# Altium schematic sheet Ext_conn.schdoc: Kasli-DIOT
size 420 x 297 mm; EDA_Number: ARTIQ; Projet: ARTIQ/SINARA; Author: G.Kasprowicz; CompanyName: WUT ISE; DrawnBy: F.Świtakowski; Organization: WUT ISE; Address1: PW ISE; Address2: Nowowiejska 15/19 00-665 Warsaw; Address3: gkasprow@gmail.com; DocumentNumber: 16; SheetNumber: 13; SheetTotal: 16; ModifiedBy: -; CheckedDate: -; Title2: Ext conn; DivGrp: WUT ISE; Designer: F.Świtakowski; ModifiedDate: -; ProjectName: Sensor Box
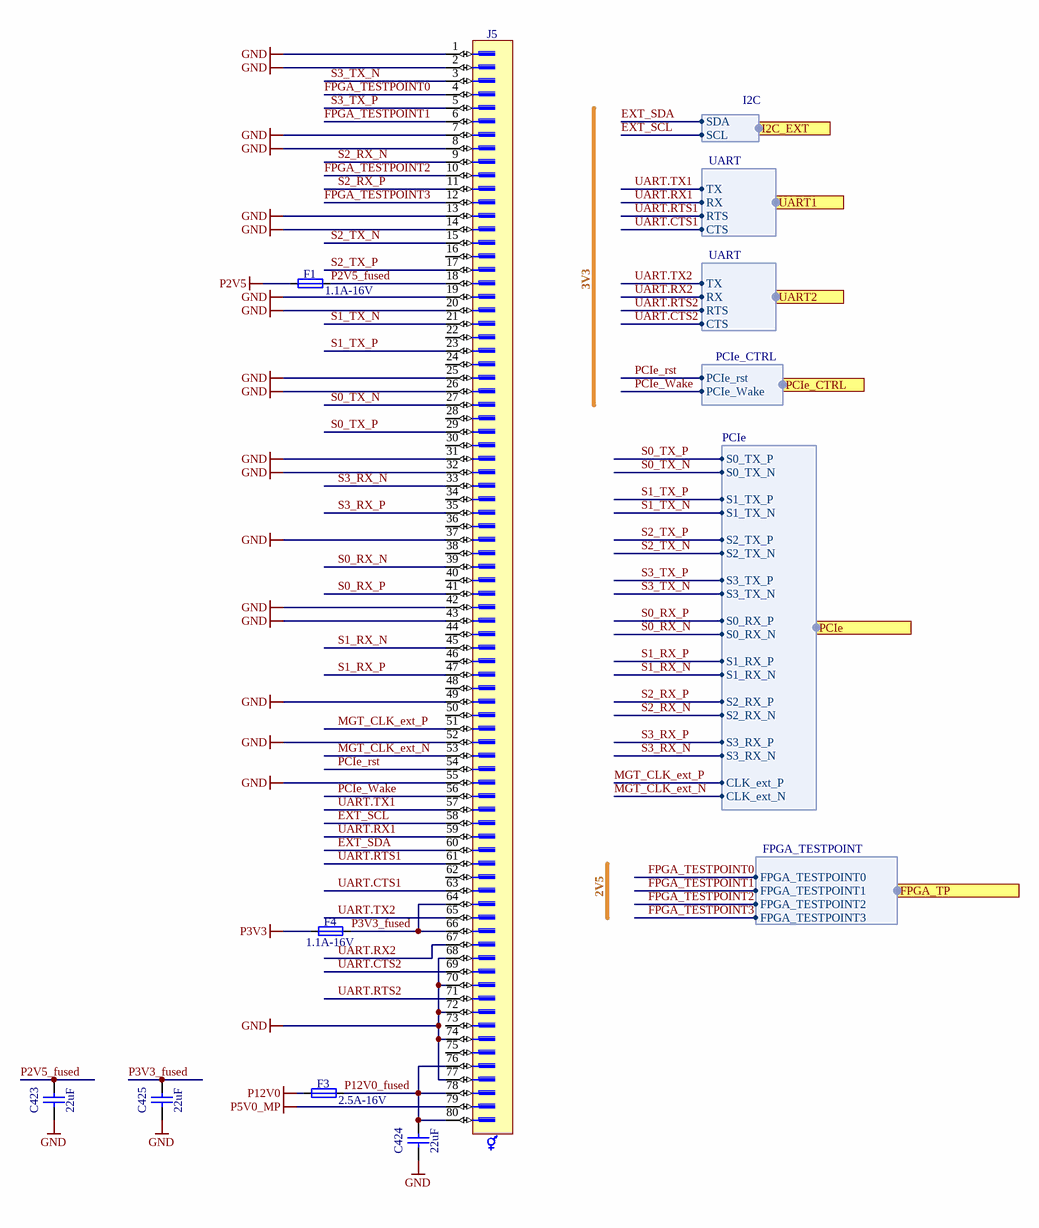
[diagram p0: Ext_conn.schdoc]

## Parts
C423  22uF  [CAPC2012X135N]
C424  22uF  [CAPC2012X135N]
C425  22uF  [CAPC2012X135N]
F1  1.1A-16V  [FUSR_BOURNS_MF-MSMF_STYLE1(H85)]
F3  2.5A-16V  [FUSR_BOURNS_MF-MSMF_STYLE2]
F4  1.1A-16V  [FUSR_BOURNS_MF-MSMF_STYLE1(H85)]
J5  (no value)  [SAMTEC_LSS-140-01-L-DV-A]

## Ports
FPGA_TP (harness FPGA_TESTPOINT), I2C_EXT (harness i2C), PCIe (harness PCIe), PCIe_CTRL (harness PCIe_CTRL), UART1 (harness UART), UART2 (harness UART)

## Harnesses
UART: TX, RX, RTS, CTS
PCIe_CTRL: PCIe_rst, PCIe_Wake
PCIe: S0_TX_P, S0_TX_N, S1_TX_P, S1_TX_N, S2_TX_P, S2_TX_N, S3_TX_P, S3_TX_N, S0_RX_P, S0_RX_N, S1_RX_P, S1_RX_N, S2_RX_P, S2_RX_N, S3_RX_P, S3_RX_N, CLK_ext_P, CLK_ext_N
FPGA_TESTPOINT: FPGA_TESTPOINT0, FPGA_TESTPOINT1, FPGA_TESTPOINT2, FPGA_TESTPOINT3
I2C: SDA, SCL

## Nets
GND: C423.1 C424.1 C425.1 J5.1 J5.2 J5.7 J5.8 J5.13 J5.14 J5.19 J5.20 J5.25 J5.26 J5.31 J5.32 J5.37 J5.42 J5.43 J5.49 J5.52 J5.55 J5.68 J5.70 J5.72 J5.74 J5.77
P2V5: F1.1
P3V3: F4.1
P5V0_MP: J5.79
P12V0: F3.1
EXT_SCL: J5.58 ; port I2C_EXT.SCL
EXT_SDA: J5.60 ; port I2C_EXT.SDA
FPGA_TESTPOINT0: J5.4 ; port FPGA_TP.FPGA_TESTPOINT0
FPGA_TESTPOINT1: J5.6 ; port FPGA_TP.FPGA_TESTPOINT1
FPGA_TESTPOINT2: J5.10 ; port FPGA_TP.FPGA_TESTPOINT2
FPGA_TESTPOINT3: J5.12 ; port FPGA_TP.FPGA_TESTPOINT3
MGT_CLK_ext_N: J5.53 ; port PCIe.CLK_ext_N
MGT_CLK_ext_P: J5.51 ; port PCIe.CLK_ext_P
P2V5_fused: C423.2 F1.2 J5.18
P3V3_fused: C425.2 F4.2 J5.64 J5.66
P12V0_fused: C424.2 F3.2 J5.76 J5.78 J5.80
PCIe_rst: J5.54 ; port PCIe_CTRL.PCIe_rst
PCIe_Wake: J5.56 ; port PCIe_CTRL.PCIe_Wake
S0_RX_N: J5.39 ; port PCIe.S0_RX_N
S0_RX_P: J5.41 ; port PCIe.S0_RX_P
S0_TX_N: J5.27 ; port PCIe.S0_TX_N
S0_TX_P: J5.29 ; port PCIe.S0_TX_P
S1_RX_N: J5.45 ; port PCIe.S1_RX_N
S1_RX_P: J5.47 ; port PCIe.S1_RX_P
S1_TX_N: J5.21 ; port PCIe.S1_TX_N
S1_TX_P: J5.23 ; port PCIe.S1_TX_P
S2_RX_N: J5.9 ; port PCIe.S2_RX_N
S2_RX_P: J5.11 ; port PCIe.S2_RX_P
S2_TX_N: J5.15 ; port PCIe.S2_TX_N
S2_TX_P: J5.17 ; port PCIe.S2_TX_P
S3_RX_N: J5.33 ; port PCIe.S3_RX_N
S3_RX_P: J5.35 ; port PCIe.S3_RX_P
S3_TX_N: J5.3 ; port PCIe.S3_TX_N
S3_TX_P: J5.5 ; port PCIe.S3_TX_P
UART.CTS1: J5.63 ; port UART1.CTS
UART.CTS2: J5.69 ; port UART2.CTS
UART.RTS1: J5.61 ; port UART1.RTS
UART.RTS2: J5.71 ; port UART2.RTS
UART.RX1: J5.59 ; port UART1.RX
UART.RX2: J5.67 ; port UART2.RX
UART.TX1: J5.57 ; port UART1.TX
UART.TX2: J5.65 ; port UART2.TX

Not connected (* = marked no-connect by the designer): J5 16 22 24 28 30 34 36 38 40 44 46 48 50 62 73 75

## Notes on the sheet
- 3V3
- 2V5
- Project/Equipment
- Document
- Designer
- Drawn by
- Check.by
- Copyright WUT ISE 2024.
  This documentation describes Open Hardware and is licensed under the CERN OHL-W v.2.0. You may redistribute and modify this documentation under the terms of the CERN OHL-W v.2.0. (http://ohwr.org/CERNOHL). This documentation is distributed WITHOUT ANY EXPRESS OR IMPLIED WARRANTY, INCLUDING OF MERCHANTABILITY, SATISFACTORY QUALITY AND FITNESS FOR A PARTICULAR PURPOSE. Please see the CERN OHL v.2.0 for applicable conditions.
- Contact
- File
- Last Mod.
- Print Date
- Sheet
- Size
- A3
- of
- Rev

## Library data of the parts
C423-C425 = CC0805_22UF_16V_10%_X5R: Non-polarised capacitor; Manufacturer: GENERIC; Part Description: SMD Multilayer Chip Ceramic Capacitor; Manufacturer1 Part Number: C2012X5R1C226KT; Tolerance: ±10%; Voltage: 16V; TC: X5R; Manufacturer Part Number: CC0805_22UF_16V_10%_X5R; Part Number: CC0805_22UF_16V_10%_X5R; Value: 22uF; Component Kind: Standard; Component Type: Standard; Pin Count: 2; Status: Preferred; Case: 0805; Mounted: Yes; Socket: No; SMD: Yes; Sense: No; Manufacturer1 Example: TDK; Manufacturer1 ComponentHeight: 1.35mm; HelpURL: \\cern.ch\dfs\Applications\Altium\Datasheets\CC0805_X5R_TDK_C.pdf; Author: CERN DEM JLC; CreateDate: 25.10.2012; LatestRevisionDate: 25.10.2012
F1 F4 = FUSR_BOURNS_MF-MSMF110/16-2: Fuse; Part Description: PTC Resettable Fuse; Manufacturer: BOURNS; PressFit: No; Part Number: FUSR_BOURNS_MF-MSMF110/16-2; Component Kind: Standard; Component Type: Standard; Pin Count: 2; PackageDescription: PTC Resettable Fuse, MF-MSMS Series, Case Style 1 Height 0.85mm; Family: Fuses Resettable; Mounted: Yes; Socket: No; SMD: Yes; Sense: No; Value: 1.1A-16V; Manufacturer Part Number: MF-MSMF110/16; ComponentHeight: 0.85mm; HelpURL: \\cern.ch\dfs\Applications\Altium\Datasheets\FUSR_BOURNS_MF-MSMF.pdf; Author: CERN DEM JLC; CreateDate: 02.03.2011; LatestRevisionDate: 20.06.2023
F3 = FUSR_BOURNS_MF-MSMF250/16X-2: Fuse; Part Description: PTC Resettable Fuse; Manufacturer: BOURNS; PressFit: No; Part Number: FUSR_BOURNS_MF-MSMF250/16X-2; Component Kind: Standard; Component Type: Standard; Pin Count: 2; PackageDescription: PTC Resettable Fuse, MF-MSMS Series, Case Style 2; Family: Fuses Resettable; Mounted: Yes; Socket: No; SMD: Yes; Sense: No; Value: 2.5A-16V; Manufacturer Part Number: MF-MSMF250/16X; ComponentHeight: 1.6mm; HelpURL: \\cern.ch\dfs\Applications\Altium\Datasheets\FUSR_BOURNS_MF-MSMF.pdf; Author: CERN DEM JLC; CreateDate: 02.03.2011; LatestRevisionDate: 20.06.2023
J5 = SAMTEC_LSS-140-01-L-DV-A: Connector 80 Hermaphroditic; Part Description: 80 Contacts, Pitch 0.635mm, Razor Beam LSS Vertical High Speed Hermaphroditic Strip (Lead Style 4.5mm); Manufacturer: SAMTEC; PressFit: No; Part Number: SAMTEC_LSS-140-01-L-DV-A; Component Kind: Standard; Component Type: Standard; Pin Count: 80; Mounted: Yes; Socket: No; SMD: Yes; Sense: No; Status: None; Manufacturer Part Number: LSS-140-01-L-DV-A; ComponentHeight: 4.57mm; HelpURL: \\cern.ch\dfs\Applications\Altium\Datasheets\SAMTEC_LSS-140-01-L-DV-A.pdf; Author: CERN DEM JMW; CreateDate: 10.11.2015; LatestRevisionDate: 10.11.2015